# EAGLE design crz7shlda0 (EAGLE 9.6.2)

## Sheet 1 of 2
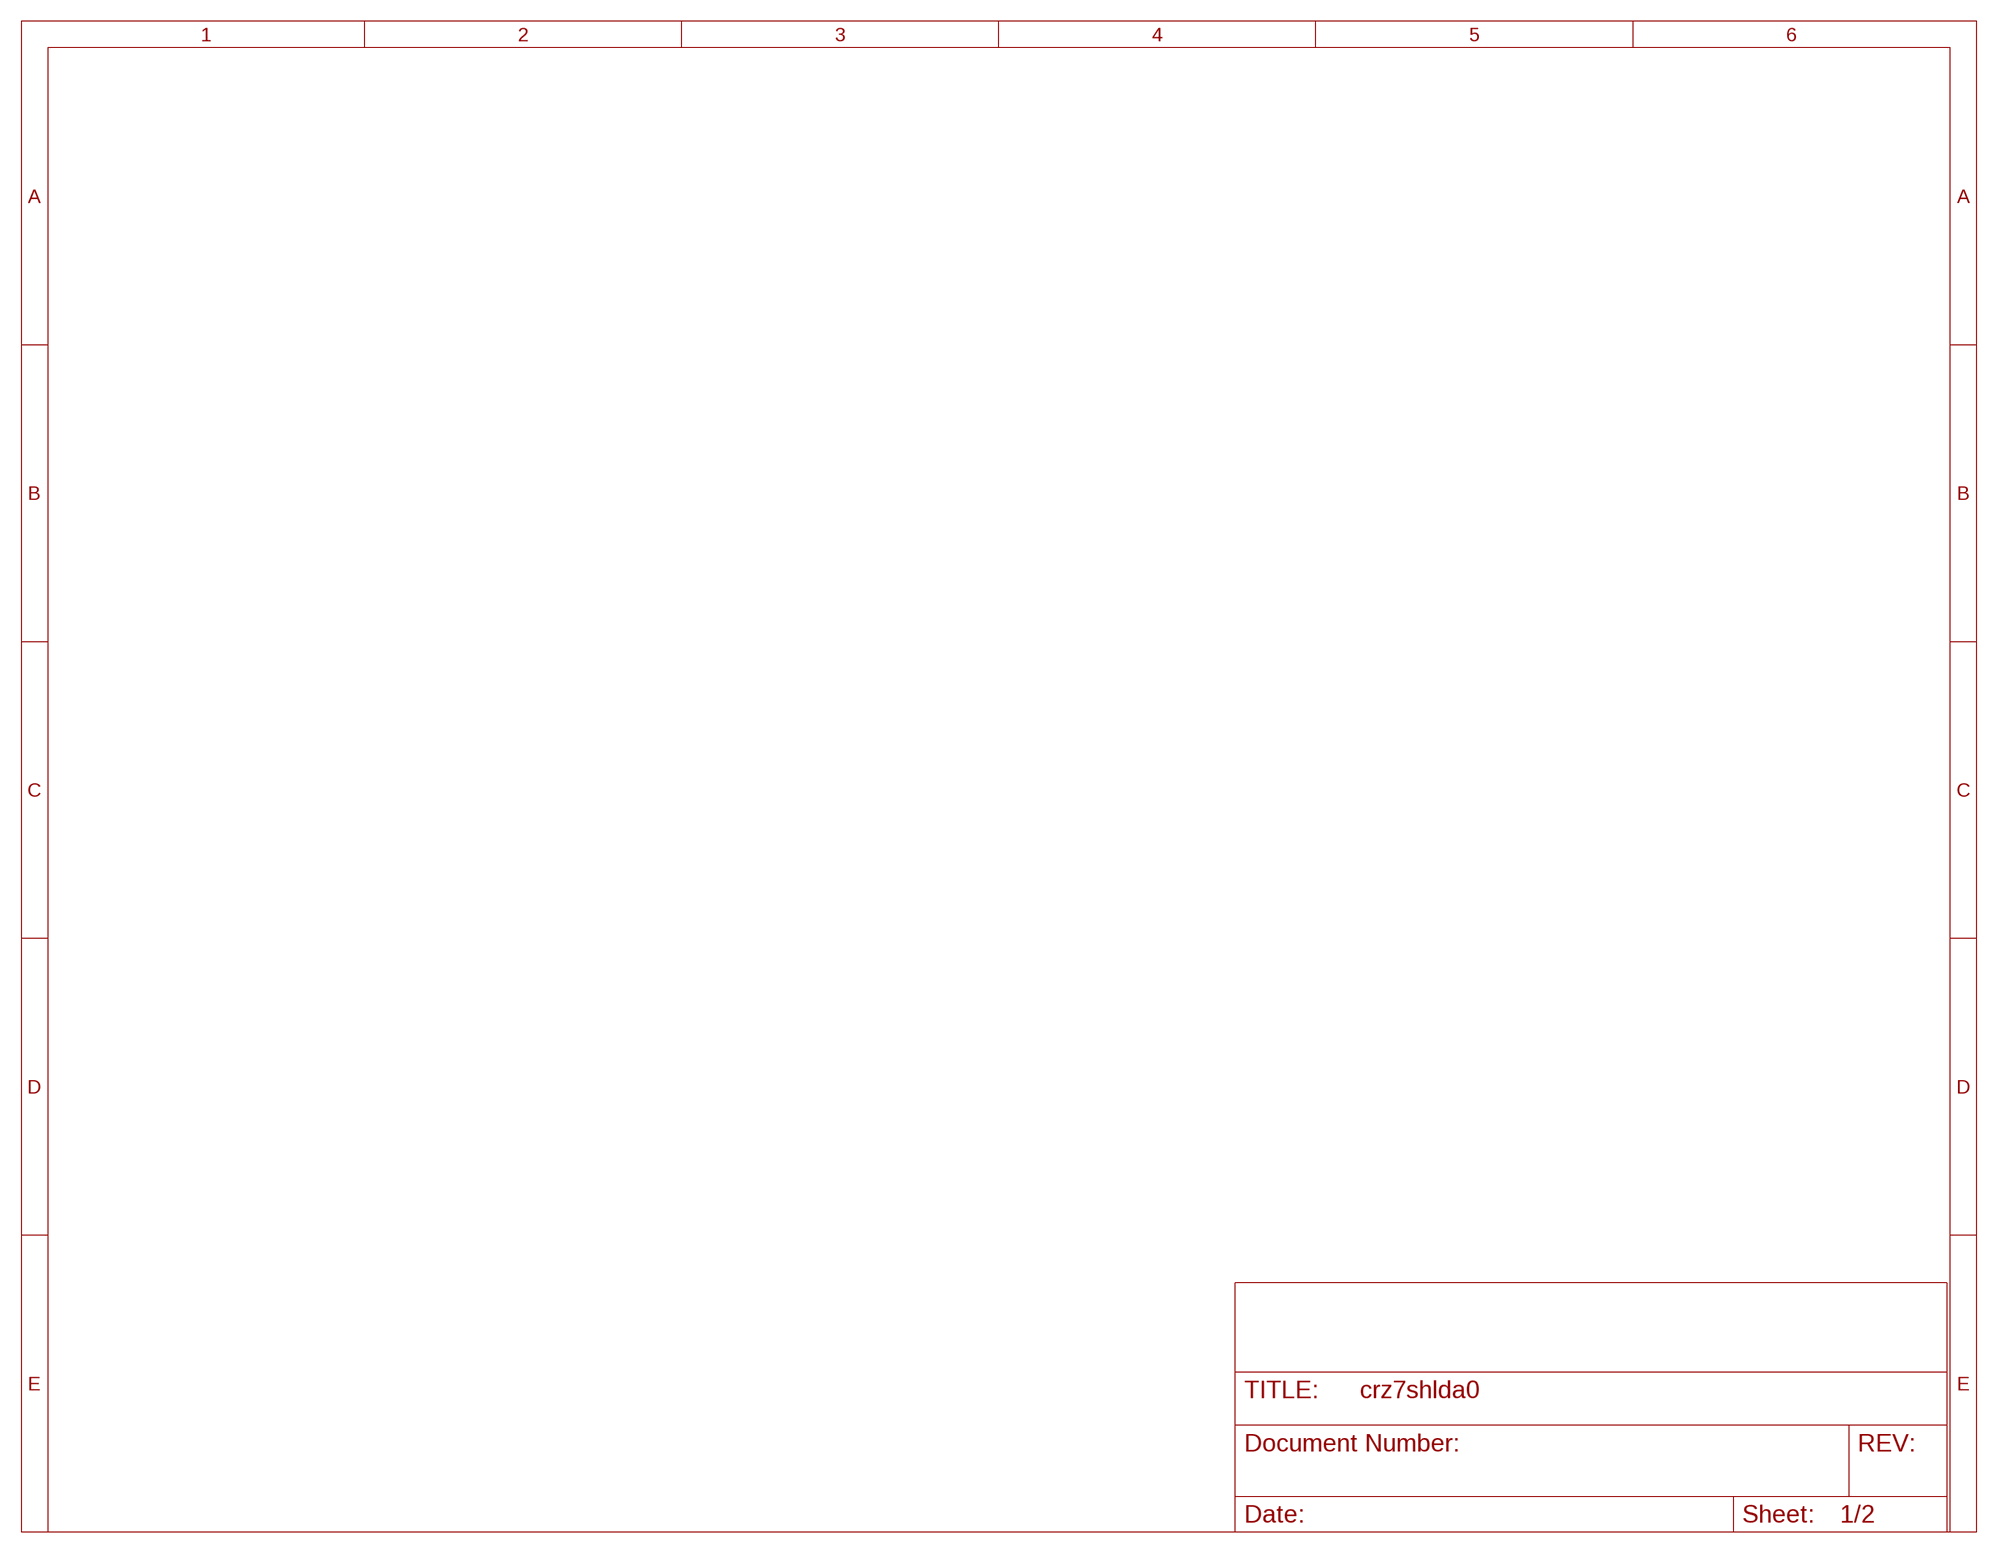
[diagram p0: schematic, sheet 1]

## Sheet 2 of 2
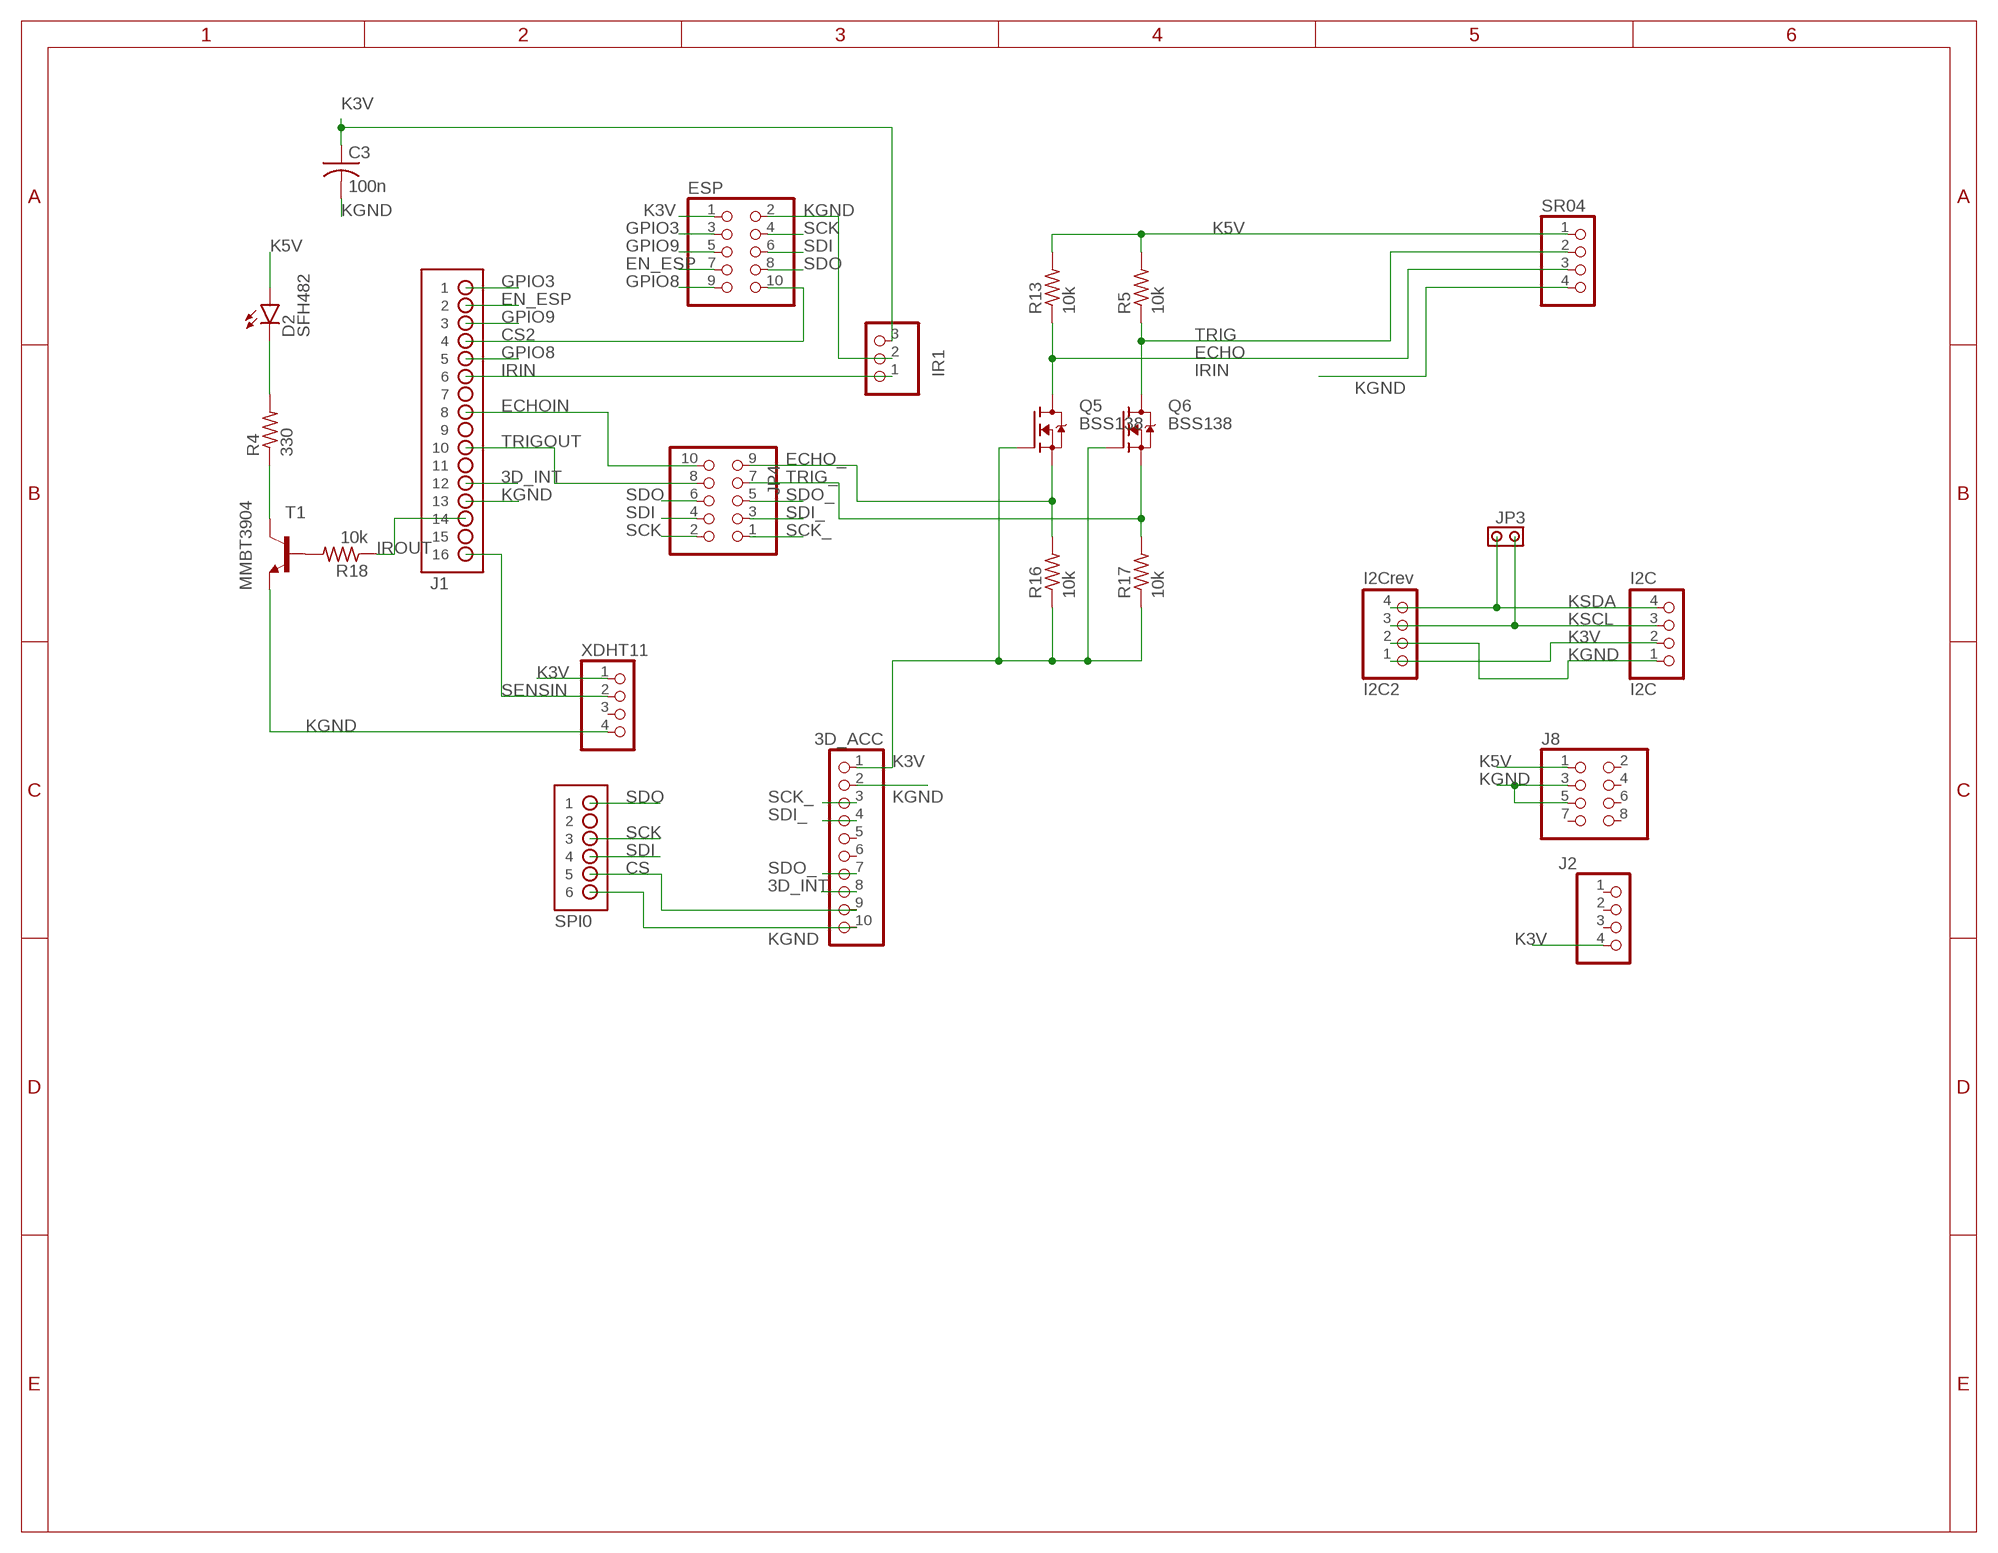
[diagram p1: schematic, sheet 2]

### Parts
3D_ACC  PINHD-1X10  [1X10]
C3  100n  C-USC0402  [C0402]
D2  SFH482  [SFH482]
ESP  PINHD-2X5  [2X05]
I2C  I2C  PINHD-1X4  [1X04]
I2C2  I2Crev  PINHD-1X4  [1X04]
IR1  PINHD-1X3  [1X03]
J1  HDR-2X8  [HDR-2X8]
J2  PINHD-1X4  [1X04]
J8  PINHD-2X4  [2X04]
JP3  JPR-1X2  [JPR-1X2]
JP4  PINHD-2X5  [2X05]
Q5  BSS138  [SOT23]
Q6  BSS138  [SOT23]
R4  330  R-US_R0402  [R0402]
R5  10k  R-US_R0402  [R0402]
R13  10k  R-US_R0402  [R0402]
R16  10k  R-US_R0402  [R0402]
R17  10k  R-US_R0402  [R0402]
R18  10k  R-US_R0402  [R0402]
SPI0  HDR-2X3  [HDR-2X3]
SR04  PINHD-1X4  [1X04]
T1  MMBT3904  MMBT3904LT1-NPN-SOT23-BEC  [SOT23-BEC]
XDHT11  PINHD-1X4  [1X04]

### Nets
3D_INT: 3D_ACC.8 J1.12
CS: 3D_ACC.9 SPI0.5
CS2: ESP.10 J1.4
ECHO: Q5.3(D) R13.1 SR04.3
ECHO_: JP4.9 Q5.2(S) R16.2
ECHOIN: J1.8 JP4.10
EN_ESP: ESP.7 J1.2
GPIO3: ESP.3 J1.1
GPIO8: ESP.9 J1.5
GPIO9: ESP.5 J1.3
IRIN: IR1.1 J1.6
IROUT: J1.14 R18.1
K3V: 3D_ACC.1 C3.1 ESP.1 I2C2.1 I2C.2 IR1.3 J2.4 Q5.1(G) Q6.1(G) R16.1 R17.1 XDHT11.1
K5V: D2.A J8.1 R5.2 R13.2 SR04.1
KGND: 3D_ACC.2 3D_ACC.10 C3.2 ESP.2 I2C2.2 I2C.1 IR1.2 J1.13 J8.3 J8.5 SPI0.6 SR04.4 T1.E XDHT11.4
KSCL: I2C2.3 I2C.3 JP3.2
KSDA: I2C2.4 I2C.4 JP3.1
N$3: R4.1 T1.C
N$5: D2.K(C) R4.2
N$9: R18.2 T1.B
SCK: ESP.4 JP4.2 SPI0.3
SCK_: 3D_ACC.3 JP4.1
SDI: ESP.6 JP4.4 SPI0.4
SDI_: 3D_ACC.4 JP4.3
SDO: ESP.8 JP4.6 SPI0.1
SDO_: 3D_ACC.7 JP4.5
SENSIN: J1.16 XDHT11.2
TRIG: Q6.3(D) R5.1 SR04.2
TRIG_: JP4.7 Q6.2(S) R17.2
TRIGOUT: J1.10 JP4.8
Unconnected: 3D_ACC.5 3D_ACC.6 J1.7 J1.9 J1.11 J1.15 J2.1 J2.2 J2.3 J8.2 J8.4 J8.6 J8.7 J8.8 SPI0.2 XDHT11.3

## Library data of the parts
3D_ACC = pinhead2:PINHD-1X10: PIN HEADER
C3 = rcl:C-US: CAPACITOR, American symbol; SPICEPREFIX: C
D2 = led:SFH482: IR LED infrared emitting diode, Infineon
ESP JP4 = pinhead:PINHD-2X5: PIN HEADER
I2C I2C2 J2 SR04 XDHT11 = pinhead2:PINHD-1X4: PIN HEADER
IR1 = pinhead2:PINHD-1X3: PIN HEADER
J1 = Mechanical:HDR-2X8: 100mil 2x8 header
J8 = pinhead2:PINHD-2X4: PIN HEADER
JP3 = Mechanical:JPR-1X2
Q5 Q6 = bss138_10:BSS138: BSS138 N-Channel Logic Level Enhancement Mode Field Effect Transistor Source: http://www.fairchildsemi.com/datasheets/BS/BSS138.pdf; MF: Fairchild; MPN: BSS138; OC_FARNELL: 9845330; OC_NEWARK: 67R2009
R4 R5 R13 R16-R18 = rcl:R-US_: RESISTOR, American symbol; SPICEPREFIX: R
SPI0 = Mechanical:HDR-2X3
T1 = transistor:*-NPN-: NPN Transistror BF959 corrected 2008.03.06

## Board
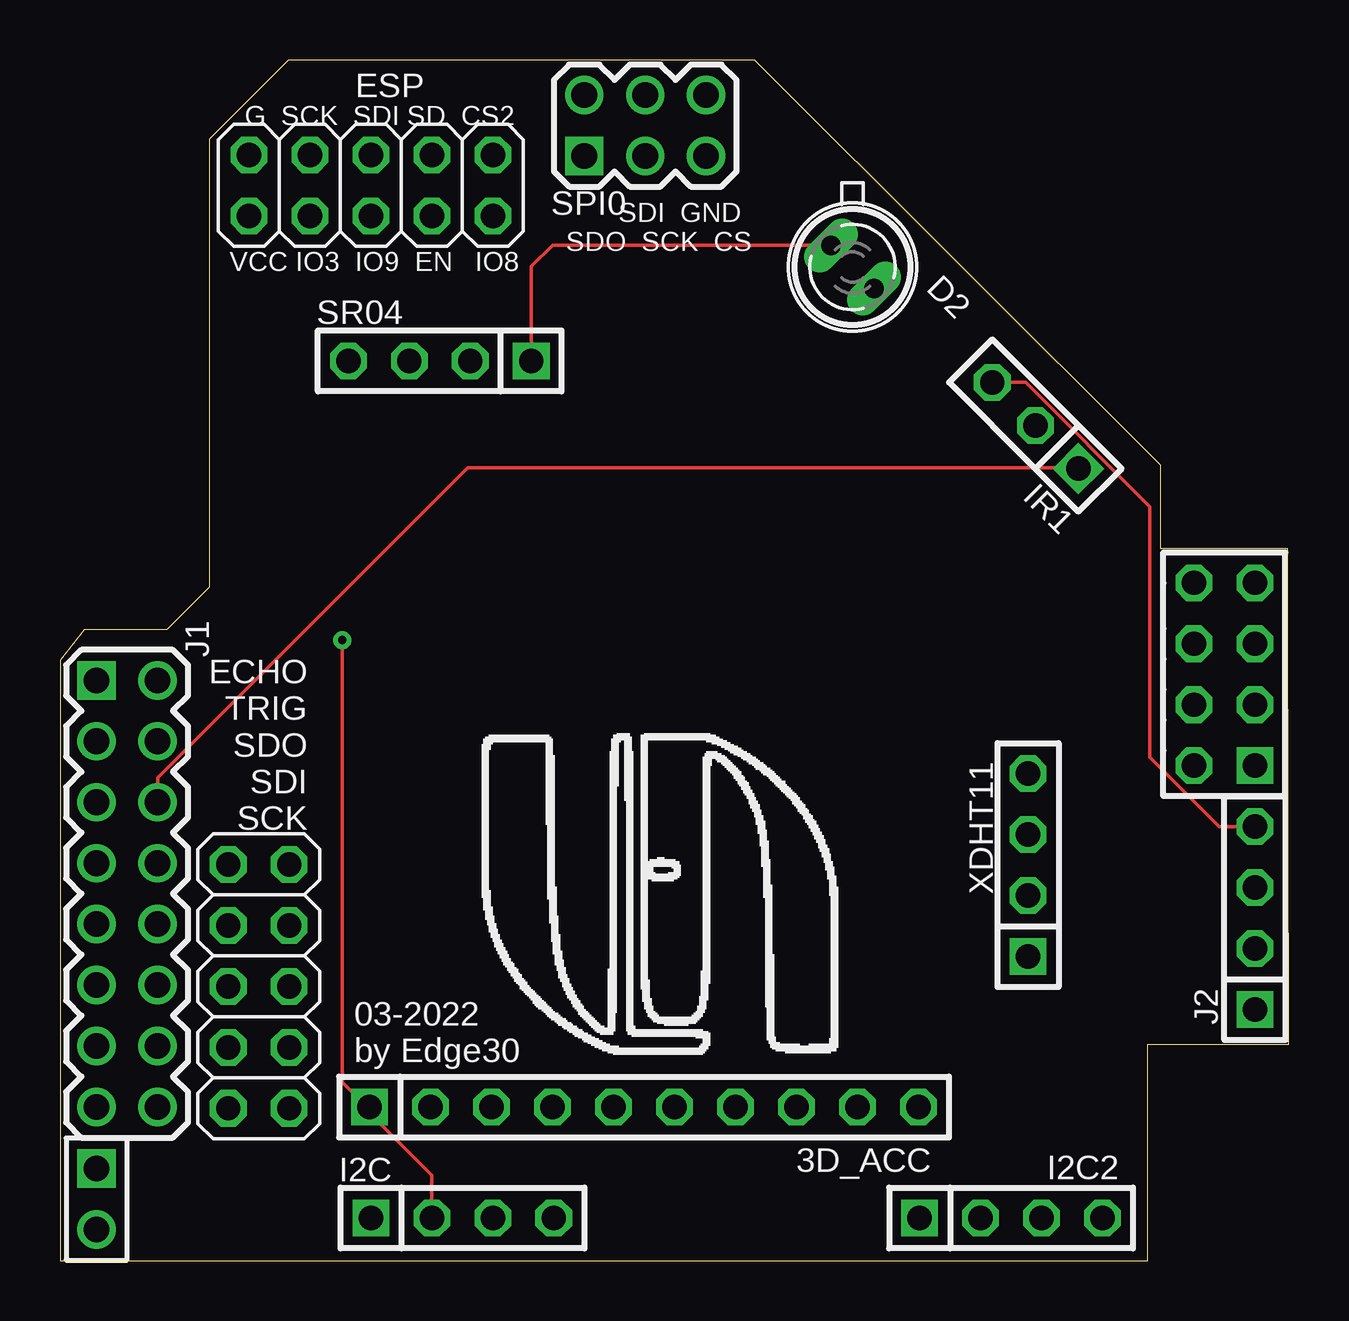
[diagram p2: board, top side]
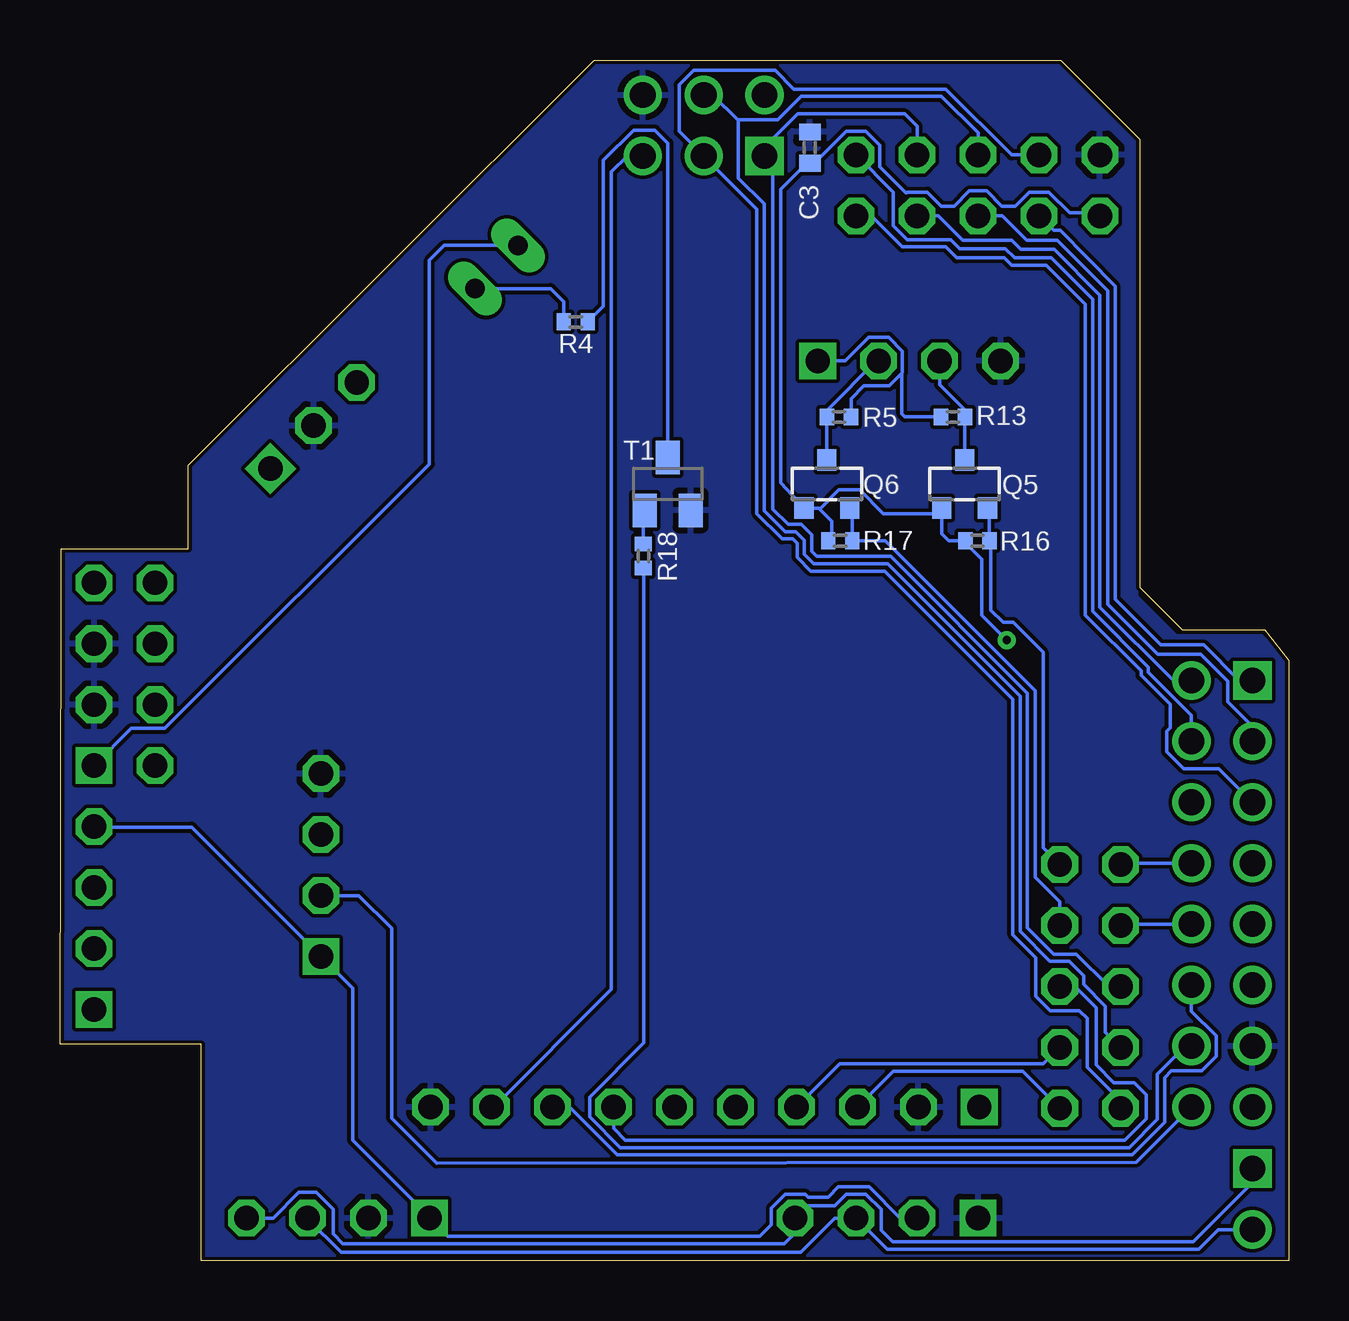
[diagram p3: board, bottom side, seen from below]

Size 51.21 x 50.03 mm. Coordinates in mm from the lower left corner, seen from the top.
Outline: 0,0 45.31,0 45.31,9.02 51.21,9.02 51.16,27.64 51.16,29.67 45.87,29.67 45.87,33.15 28.96,50.03 9.52,50.03 6.21,46.73 6.22,28.07 4.45,26.29 1.02,26.29 0,25.02 0,0
Copper layers (1*16): Top 0.035mm / dielectric 0.15mm / Bottom 0.035mm
Design rules "default *": minimum track width 6mil, minimum drill 0.35mm, track to track 6mil, track to pad 6mil, pad to pad 6mil, via to via 6mil, smd to smd 6mil, copper to edge 6mil, drill to drill 6mil, minimum pad ring 10mil, minimum via ring 8mil, stop-mask expansion 4mil, vias tented up to drill 0mil, thermal gap 10mil

### Footprints (pad centres in the part's own frame; a part is rotated, then mirrored left to right if it is on the bottom)
1X10 = drill 1.016 square: 1 -11.43,0 | drill 1.016 octagon: 2 -8.89,0; 3 -6.35,0; 4 -3.81,0; 5 -1.27,0; 6 1.27,0; 7 3.81,0; 8 6.35,0; 9 8.89,0; 10 11.43,0
C0402 = smd 0.7 x 0.9: 1 -0.65,0; 2 0.65,0
SFH482 = drill 0.813 long: A -1.27,0; K 1.27,0
2X05 = drill 1.016 octagon: 1 -5.08,-1.27; 2 -5.08,1.27; 3 -2.54,-1.27; 4 -2.54,1.27; 5 0,-1.27; 6 0,1.27; 7 2.54,-1.27; 8 2.54,1.27; 9 5.08,-1.27; 10 5.08,1.27
1X04 = drill 1.016 square: 1 -3.81,0 | drill 1.016 octagon: 2 -1.27,0; 3 1.27,0; 4 3.81,0
1X03 = drill 1.016 square: 1 -2.54,0 | drill 1.016 octagon: 2 0,0; 3 2.54,0
HDR-2X8 = drill 1.067 square: 1 -1.27,8.89 | drill 1.067: 2 1.27,8.89; 3 -1.27,6.35; 4 1.27,6.35; 5 -1.27,3.81; 6 1.27,3.81; 7 -1.27,1.27; 8 1.27,1.27; 9 -1.27,-1.27; 10 1.27,-1.27; 11 -1.27,-3.81; 12 1.27,-3.81; 13 -1.27,-6.35; 14 1.27,-6.35; 15 -1.27,-8.89; 16 1.27,-8.89
2X04 = drill 1.016 square: 1 -3.81,-1.27 | drill 1.016 octagon: 2 -3.81,1.27; 3 -1.27,-1.27; 4 -1.27,1.27; 5 1.27,-1.27; 6 1.27,1.27; 7 3.81,-1.27; 8 3.81,1.27
JPR-1X2 = drill 1.067 square: 1 0,1.27 | drill 1.067: 2 0,-1.27
SOT23 = smd 0.8 x 0.9: 1 -0.95,-1; 2 0.95,-1; 3 0,1
R0402 = smd 0.6 x 0.7: 1 -0.5,0; 2 0.5,0
HDR-2X3 = drill 1.067 square: 1 -1.27,2.54 | drill 1.067: 2 1.27,2.54; 3 -1.27,0; 4 1.27,0; 5 -1.27,-2.54; 6 1.27,-2.54
SOT23-BEC = smd 1 x 1.4: B -0.95,-1.1; C 0,1.1; E 0.95,-1.1

### Placement (x,y rotation side)
3D_ACC  24.33,6.4 0 top
C3  19.96,46.38 90 bottom
D2  33.02,41.4 315 top
ESP  12.95,44.81 0 top
I2C  16.76,1.78 0 top
I2C2  39.62,1.78 0 top
IR1  40.64,34.8 135 top
J1  2.79,15.29 0 top
J2  49.78,14.27 90 top
J8  48.51,24.43 90 top
JP3  1.52,2.57 0 top
JP4  8.28,11.43 90 top
Q5  13.51,32.36 0 bottom
Q6  19.25,32.36 0 bottom
R4  29.72,39.12 180 bottom
R5  18.75,35.15 0 bottom
R13  14,35.15 180 bottom
R16  12.98,30 0 bottom
R17  18.69,30 0 bottom
R18  26.9,29.36 90 bottom
SPI0  24.38,47.29 90 top
SR04  15.82,37.49 180 top
T1  25.88,32.36 0 bottom
XDHT11  40.34,16.48 90 top

### Tracks (layer width: path | path; a pad name or v marks a point on that pad's centre or on a via)
3D_INT
  Bottom 0.152: 3D_ACC.8 29.98,6.4 27.98,4.41 6.53,4.41 5.18,5.76 5.18,7.63 4.9,7.91 3.64,7.91 3.04,8.52 3.04,9.37 4.06,10.4 J1.12
CS
  Bottom 0.152: 3D_ACC.9 33.13,6.4 28.23,11.3 28.23,45.36 27.57,46.02 SPI0.5
CS2
  Bottom 0.152: ESP.10 16.48,44.53 16.48,43.12 15.9,42.55 14.1,42.55 13.72,42.16 11.81,42.16 11.43,41.78 9.91,41.78 8.18,40.06 8.18,27.05 5.86,24.73 5.86,24.52 4.06,22.73 J1.4
ECHO
  Bottom 0.152: SR04.3 14.55,36.5 13.49,35.44 R13.1 13.51,35.14 Q5.3
ECHO_
  Bottom 0.152: JP4.9 10.24,17.2 10.24,25.35 11.48,26.59 11.91,26.59 12.43,27.11 12.43,29.95 R16.2 12.48,31.28 Q5.2
ECHOIN
  Bottom 0.152: JP4.10 6.99,16.56 J1.8
EN_ESP
  Bottom 0.152: ESP.7 14.61,43.54 13.59,42.52 11.56,42.52 11.18,42.14 9.78,42.14 7.87,40.23 7.87,27.23 4.83,24.18 J1.2
GPIO3
  Bottom 0.152: J1.1 2.08,24.18 3.56,25.65 5.33,25.65 7.24,27.56 7.24,40.59 9.52,42.93 9.8,42.93 ESP.3
GPIO8
  Bottom 0.152: ESP.9 17.4,43.54 16.1,42.24 14.3,42.24 13.84,41.78 11.86,41.78 11.56,41.48 10.11,41.48 8.48,39.85 8.48,26.9 6.16,24.57 6.16,24.39 4.95,23.18 4.95,22.21 5.09,22.07 5.09,21.21 4.38,20.5 2.92,20.5 J1.5
GPIO9
  Bottom 0.152: 2.55,24.14 2.55,23.29 1.52,22.26 J1.3 | ESP.5 11.94,43.54 10.92,42.52 9.65,42.52 7.54,40.41 7.54,27.36 5.46,25.27 3.68,25.27 2.55,24.14 | 2.55,24.14
IRIN
  Top 0.152: IR1.1 42.39,33.05 16.99,33.05 4.06,20.12 J1.6
IROUT
  Bottom 0.152: R18.1 26.87,28.86 26.87,9.07 29.13,6.81 29.13,5.99 27.86,4.71 6.66,4.71 5.49,5.88 5.49,7.77 4.32,8.94 J1.14
K3V  (via drill 0.35)
  Top 0.152: I2C.2 15.49,3.56 12.9,6.15 3D_ACC.1 12.8,6.4 11.76,7.44 v11.76,25.86 | IR1.3 40.24,36.59 45.41,31.42 45.41,20.98 48.31,18.09 J2.4
  Bottom 0.152: I2C.2 16.2,1.78 17.5,3.07 18.77,3.07 19.2,2.64 20.04,2.64 20.16,2.77 20.98,2.77 21.57,2.19 21.57,1.5 22.05,1.02 35.05,1.02 I2C2.1 35.81,1.82 39.01,5.03 39.01,11.35 XDHT11.1 45.72,18.06 49.76,18.06 J2.4 | 13.45,30.03 R16.1 | 14.49,31.54 14.49,31.33 Q5.1 | R16.1 13.48,29.92 12.79,29.23 12.79,26.89 v11.76,25.86 | R16.1 13.32,30 | Q6.1 21.18,32.42 21.18,44.64 20.09,45.73 C3.1 19.78,45.73 18.44,47.07 17.62,47.07 17.04,46.49 17.04,45.59 15.96,44.5 15.93,44.5 15.9,44.53 15.06,44.53 14.48,43.94 13.95,43.94 13.31,44.58 12.59,44.58 11.96,43.94 11.41,43.94 10.82,44.53 10,44.53 9.14,43.66 8,43.66 ESP.1 | R16.1 14.17,30 14.46,30.29 Q5.1 | Q6.1 19.52,31.36 18.76,32.11 17.89,32.11 16.9,31.13 14.69,31.13 Q5.1 | Q6.1 19.59,31.36 19.04,30.81 19.04,30.15 R17.1
K5V
  Top 0.152: D2.A 31.36,42.3 31.34,42.32 20.52,42.32 19.63,41.43 SR04.1
  Bottom 0.152: J8.1 48.23,22.17 46.83,22.17 35.81,33.19 35.81,41.68 35.2,42.3 D2.A | R5.2 18.25,35.92 17.71,36.45 16.66,36.45 16.13,36.98 | 16.13,36.98 16.1,37.01 16.1,37.9 16.68,38.48 17.5,38.48 18.5,37.49 SR04.1 | R13.2 16,35.15 16.13,35.28 16.13,36.98
KGND
  pour Bottom (isolate 0.152): 0,0 0,24.89 1.14,26.04 4.7,26.04 6.35,27.69 6.35,46.74 9.37,49.76 9.37,49.89 28.85,49.89 45.72,33.02 45.72,29.54 51.13,29.54 51.13,9.14 45.21,9.14 45.21,0
KSCL
  Bottom 0.152: JP3.2 2.95,1.29 3.77,0.48 16.74,0.48 I2C.3 18.92,1.78 20.34,0.36 39.5,0.36 40.89,1.75 I2C2.3
KSDA
  Bottom 0.152: I2C2.4 42.32,1.78 41.25,2.85 40.54,2.85 39.83,2.13 39.83,1.12 39.42,0.71 21.03,0.71 20.57,1.17 I2C.4 20.07,2.29 18.93,2.29 18.44,2.77 17.62,2.77 16.99,2.14 16.99,1.27 16.51,0.79 3.99,0.79 1.52,3.25 JP3.1
N$3
  Bottom 0.152: R4.1 28.56,39.77 28.56,45.85 27.3,47.1 26.42,47.1 25.88,46.56 T1.C
N$5
  Bottom 0.152: D2.K 30.77,40.5 30.22,39.95 R4.2
N$9
  Bottom 0.152: T1.B 26.9,31.27 R18.2
SCK
  Bottom 0.152: JP4.2 6.71,6.35 8.41,8.05 8.41,10.09 8.73,10.41 9.94,10.41 10.54,11.02 10.54,12.62 11.51,13.58 11.51,23.39 16.85,28.73 19.92,28.73 20.5,29.31 20.5,29.9 20.67,30.07 21.12,30.07 22.17,31.12 22.17,43.81 SPI0.3 25.41,47.05 25.41,48.99 24.81,49.59 21.4,49.59 20.62,48.82 14.3,48.82 11.55,46.08 ESP.4
SCK_
  Bottom 0.152: JP4.1 11.1,7.9 16.48,7.9 3D_ACC.3
SDI
  Bottom 0.152: JP4.4 7.64,9.53 7.64,10.61 8.56,11.52 8.56,11.87 9.16,12.47 9.96,12.47 11.2,13.72 11.2,23.51 16.73,29.04 19.79,29.04 20.19,29.44 20.19,30.02 20.55,30.38 21,30.38 21.87,31.25 21.87,44.04 22.94,45.11 22.94,47.5 22.97,47.54 | SPI0.4 24,48.56 22.97,47.54 | 22.97,47.54 21.29,47.54 20.31,48.51 14.48,48.51 12.95,46.99 ESP.6
SDI_
  Bottom 0.152: 3D_ACC.4 18.72,8.2 10.24,8.2 JP4.3
SDO
  Bottom 0.152: JP4.6 7.52,11.43 8.87,12.78 9.8,12.78 10.9,13.87 10.9,23.64 16.6,29.34 19.66,29.34 19.89,29.57 19.89,30.25 20.32,30.68 20.87,30.68 21.51,31.32 21.51,45.69 SPI0.1 21.84,46.41 20.47,47.78 16,47.78 15.49,47.27 ESP.8
SDO_
  Bottom 0.152: 3D_ACC.7 28.14,5.51 27.65,5.02 6.83,5.02 5.94,5.91 5.94,6.92 6.44,7.42 7.29,7.42 8.03,8.15 8.03,10.54 8.91,11.43 JP4.5
SENSIN
  Bottom 0.152: J1.16 6.36,4.1 35.51,4.06 37.39,5.94 37.39,13.85 38.76,15.21 XDHT11.2
TRIG
  Bottom 0.152: SR04.2 17.19,37.49 19.25,35.43 R5.1 Q6.3
TRIG_
  Bottom 0.152: JP4.7 9.55,14.96 10.57,15.98 10.57,23.75 16.82,30 R17.2 18.19,31.33 Q6.2
TRIGOUT
  Bottom 0.152: J1.10 6.99,14.02 JP4.8

### Text on the board
tPlace: SDI GND / SDO SCK CS | G SCK SDI SD CS2 / / / / / VCC IO3 IO9 EN IO8 | ECHO / TRIG / SDO / SDI / SCK | 03-2022 / by Edge30